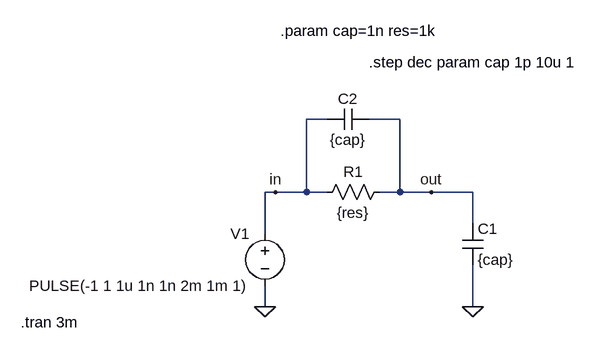
[diagram p0: schematic testfile.asc]
testfile.asc, the LTspice schematic file:
Version 4
SHEET 1 880 680
WIRE 224 -32 192 -32
WIRE 336 -32 288 -32
WIRE 144 80 128 80
WIRE 192 80 192 -32
WIRE 192 80 144 80
WIRE 224 80 192 80
WIRE 336 80 336 -32
WIRE 336 80 304 80
WIRE 384 80 336 80
WIRE 448 80 384 80
WIRE 448 128 448 80
WIRE 128 144 128 80
WIRE 128 256 128 224
WIRE 448 256 448 192
FLAG 128 256 0
FLAG 448 256 0
FLAG 384 80 out
FLAG 144 80 in
SYMBOL voltage 128 128 M0
WINDOW 123 0 0 Left 0
WINDOW 39 0 0 Left 0
SYMATTR InstName V1
SYMATTR Value PULSE(-1 1 1u 1n 1n 2m 1m 1)
SYMBOL res 320 64 R90
WINDOW 0 0 56 VBottom 2
WINDOW 3 32 56 VTop 2
SYMATTR InstName R1
SYMATTR Value {res}
SYMBOL cap 432 128 R0
SYMATTR InstName C1
SYMATTR Value {cap}
SYMBOL cap 288 -48 R90
WINDOW 0 0 32 VBottom 2
WINDOW 3 32 32 VTop 2
SYMATTR InstName C2
SYMATTR Value {cap}
TEXT -248 280 Left 2 !.tran 3m
TEXT 152 -168 Left 2 !.param cap=1n res=1k
TEXT 288 -120 Left 2 !.step dec param cap 1p 10u 1

The netlist it stands for:
* testfile.asc
V1 in 0 PULSE(-1 1 1u 1n 1n 2m 1m 1)
R1 out in {res}
C1 out 0 {cap}
C2 out in {cap}
.tran 3m
.param cap=1n res=1k
.step dec param cap 1p 10u 1
.backanno
.end